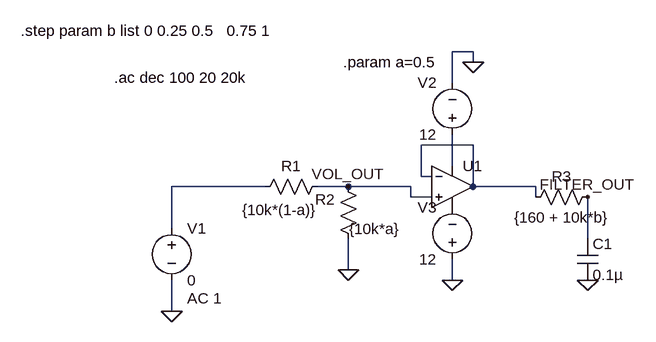
[diagram p0: schematic Deck A passive input buffer.asc]
Deck A passive input buffer.asc, the LTspice schematic file:
Version 4.1
SHEET 1 880 680
WIRE 288 -304 256 -304
WIRE 288 -288 288 -304
WIRE 256 -256 256 -304
WIRE 288 -160 208 -160
WIRE 256 -128 256 -176
WIRE 208 -112 208 -160
WIRE 224 -112 208 -112
WIRE -32 -96 -176 -96
WIRE 96 -96 48 -96
WIRE 192 -96 96 -96
WIRE 288 -96 288 -160
WIRE 384 -96 288 -96
WIRE 192 -80 192 -96
WIRE 224 -80 192 -80
WIRE 384 -80 384 -96
WIRE -176 -32 -176 -96
WIRE 464 -16 464 -80
WIRE 96 32 96 -16
WIRE 256 48 256 16
WIRE -176 96 -176 48
FLAG -176 96 0
FLAG 96 32 0
FLAG 96 -96 VOL_OUT
FLAG 464 48 0
FLAG 464 -80 FILTER_OUT
FLAG 256 48 0
FLAG 288 -288 0
SYMBOL voltage -176 -48 R0
WINDOW 123 24 124 Left 2
WINDOW 39 0 0 Left 0
SYMATTR InstName V1
SYMATTR Value 0
SYMATTR Value2 AC 1
SYMBOL res 64 -112 R90
WINDOW 0 0 56 VBottom 2
WINDOW 3 36 73 VTop 2
SYMATTR InstName R1
SYMATTR Value {10k*(1-a)}
SYMBOL res 112 0 R180
WINDOW 0 36 76 Left 2
WINDOW 3 -63 31 Left 2
SYMATTR InstName R2
SYMATTR Value {10k*a}
SYMBOL res 480 -96 R90
WINDOW 0 0 56 VBottom 2
WINDOW 3 32 56 VTop 2
SYMATTR InstName R3
SYMATTR Value {160 + 10k*b}
SYMBOL cap 448 -16 R0
SYMATTR InstName C1
SYMATTR Value 0.1µ
SYMBOL voltage 256 -160 R180
WINDOW 0 24 96 Left 2
WINDOW 3 24 16 Left 2
WINDOW 123 0 0 Left 0
WINDOW 39 0 0 Left 0
SYMATTR InstName V2
SYMATTR Value 12
SYMBOL voltage 256 32 R180
WINDOW 0 24 96 Left 2
WINDOW 3 24 16 Left 2
WINDOW 123 0 0 Left 0
WINDOW 39 0 0 Left 0
SYMATTR InstName V3
SYMATTR Value 12
SYMBOL OpAmps\\UniversalOpAmp2 256 -96 R0
SYMATTR InstName U1
TEXT -264 -264 Left 2 !.ac dec 100 20 20k
TEXT 88 -288 Left 2 !.param a=0.5
TEXT -408 -336 Left 2 !.step param b list 0 0.25 0.5   0.75 1

The netlist it stands for:
* Deck A passive input buffer.asc
V1 N003 0 0 AC 1
R1 VOL_OUT N003 {10k*(1-a)}
R2 0 VOL_OUT {10k*a}
R3 FILTER_OUT N001 {160 + 10k*b}
C1 FILTER_OUT 0 0.1µ
V2 N002 0 12
V3 0 P001 12
X§U1 VOL_OUT N001 N002 P001 N001 level2 Avol=1Meg GBW=10Meg Slew=10Meg Ilimit=25m Rail=0 Vos=0 En=0 Enk=0 In=0 Ink=0 Rin=500Meg  ; pins In+ In- V+ V- OUT
.ac dec 100 20 20k
.param a=0.5
.step param b list 0 0.25 0.5   0.75 1
.lib UniversalOpAmp2.lib
.backanno
.end